# Altium schematic sheet microcontroller.SchDoc: Microcontroller
size A4; SheetNumber: 3; SheetTotal: 7
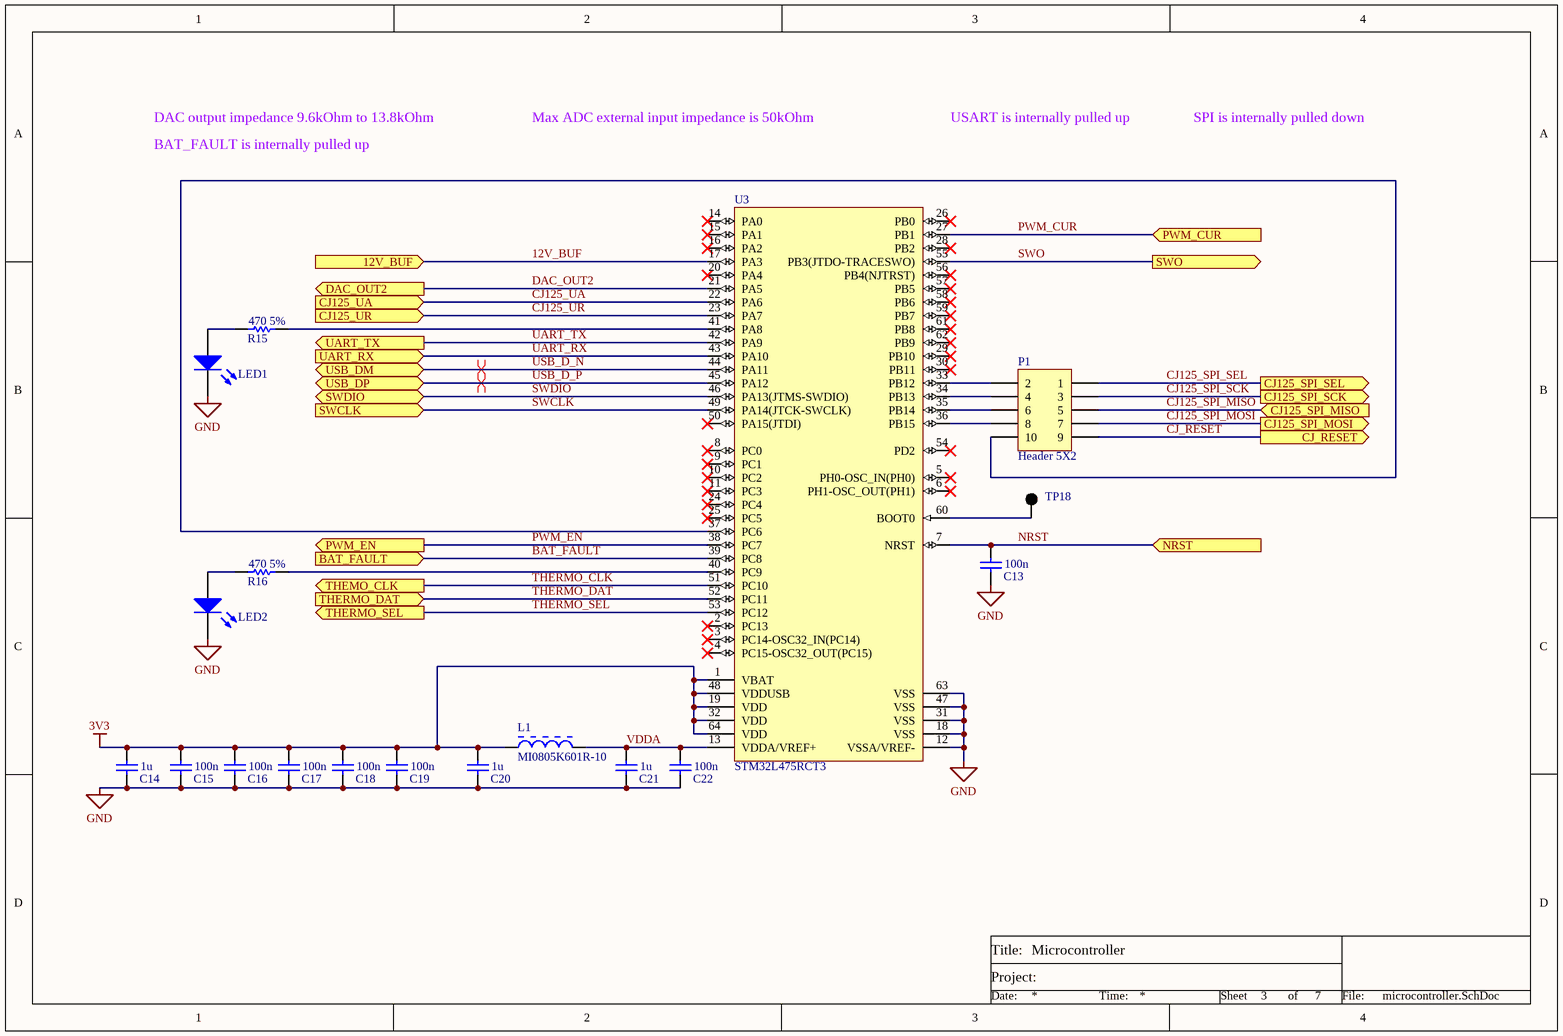
[diagram p0: microcontroller.SchDoc]

## Parts
C13  value 100n  [0805]  (hidden comment: Generic 0805 Capacitor)
C14  value 1u  [1206]  (hidden comment: Generic 1206 Capacitor)
C15  value 100n  [0805]  (hidden comment: Generic 0805 Capacitor)
C16  value 100n  [0805]  (hidden comment: Generic 0805 Capacitor)
C17  value 100n  [0805]  (hidden comment: Generic 0805 Capacitor)
C18  value 100n  [0805]  (hidden comment: Generic 0805 Capacitor)
C19  value 100n  [0805]  (hidden comment: Generic 0805 Capacitor)
C20  value 1u  [1206]  (hidden comment: Generic 1206 Capacitor)
C21  value 1u  [1206]  (hidden comment: Generic 1206 Capacitor)
C22  value 100n  [0805]  (hidden comment: Generic 0805 Capacitor)
L1  MI0805K601R-10  [0805]
LED1  150080SS75000  [0805_A]  (value not drawn)
LED2  150080SS75000  [0805_A]  (value not drawn)
P1  Header 5X2  [HDR2X5]
R15  value 470 5%  [0603]  (hidden comment: Generic 0603 Resistor)
R16  value 470 5%  [0603]  (hidden comment: Generic 0603 Resistor)
TP18  5001  [KSTN-5001]  (value not drawn)
U3  STM32L475RCT3  [STM-LQFP64_L]

## Ports
12V_BUF (in), BAT_FAULT (in), CJ125_SPI_MISO (in), CJ125_SPI_MOSI (out), CJ125_SPI_SCK (out), CJ125_SPI_SEL (out), CJ125_UA (in), CJ125_UR (in), CJ_RESET (out), DAC_OUT2 (out), NRST (in), PWM_CUR (in), PWM_EN (out), SWCLK (in), SWDIO (bidir), SWO (out), THEMO_CLK (out), THERMO_DAT (in), THERMO_SEL (out), UART_RX (in), UART_TX (out), USB_DM (bidir), USB_DP (bidir)

## Nets
3V3: C14.2 C15.2 C16.2 C17.2 C18.2 C19.2 C20.2 L1.1 U3.1(VBAT) U3.19(VDD) U3.32(VDD) U3.48(VDDUSB) U3.64(VDD)
GND: C13.1 C14.1 C15.1 C16.1 C17.1 C18.1 C19.1 C20.1 C21.1 C22.1 LED1.1(K) LED2.1(K) U3.12(VSSA/VREF-) U3.18(VSS) U3.31(VSS) U3.47(VSS) U3.63(VSS)
12V_BUF: U3.17(PA3) ; port 12V_BUF
BAT_FAULT: U3.39(PC8) ; port BAT_FAULT
CJ125_SPI_MISO: P1.5 ; port CJ125_SPI_MISO
CJ125_SPI_MOSI: P1.7 ; port CJ125_SPI_MOSI
CJ125_SPI_SCK: P1.3 ; port CJ125_SPI_SCK
CJ125_SPI_SEL: P1.1 ; port CJ125_SPI_SEL
CJ125_UA: U3.22(PA6) ; port CJ125_UA
CJ125_UR: U3.23(PA7) ; port CJ125_UR
CJ_RESET: P1.9 ; port CJ_RESET
DAC_OUT2: U3.21(PA5) ; port DAC_OUT2
NRST: C13.2 U3.7(NRST) ; port NRST
PWM_CUR: U3.27(PB1) ; port PWM_CUR
PWM_EN: U3.38(PC7) ; port PWM_EN
SWCLK: U3.49(PA14(JTCK-SWCLK)) ; port SWCLK
SWDIO: U3.46(PA13(JTMS-SWDIO)) ; port SWDIO
SWO: U3.55(PB3(JTDO-TRACESWO)) ; port SWO
THERMO_CLK: U3.51(PC10) ; port THEMO_CLK
THERMO_DAT: U3.52(PC11) ; port THERMO_DAT
THERMO_SEL: U3.53(PC12) ; port THERMO_SEL
UART_RX: U3.43(PA10) ; port UART_RX
UART_TX: U3.42(PA9) ; port UART_TX
USB_D_N: U3.44(PA11) ; port USB_DM
USB_D_P: U3.45(PA12) ; port USB_DP
VDDA: C21.2 C22.2 L1.2 U3.13(VDDA/VREF+)
NetLED1_2: LED1.2(A) R15.1
NetLED2_2: LED2.2(A) R16.1
NetP1_2: P1.2 U3.33(PB12)
NetP1_4: P1.4 U3.34(PB13)
NetP1_6: P1.6 U3.35(PB14)
NetP1_8: P1.8 U3.36(PB15)
NetP1_10: P1.10 U3.37(PC6)
NetR15_2: R15.2 U3.41(PA8)
NetR16_2: R16.2 U3.40(PC9)
NetTP18_1: TP18.1 U3.60(BOOT0)

Not connected (* = marked no-connect by the designer): U3 2(PC13)* 3(PC14-OSC32_IN(PC14))* 4(PC15-OSC32_OUT(PC15))* 5(PH0-OSC_IN(PH0))* 6(PH1-OSC_OUT(PH1))* 8(PC0)* 9(PC1)* 10(PC2)* 11(PC3)* 14(PA0)* 15(PA1)* 16(PA2)* 20(PA4)* 24(PC4)* 25(PC5)* 26(PB0)* 28(PB2)* 29(PB10)* 30(PB11)* 50(PA15(JTDI))* 54(PD2)* 56(PB4(NJTRST))* 57(PB5)* 58(PB6)* 59(PB7)* 61(PB8)* 62(PB9)*

## Layout directives
differential pair: USB_D_N, USB_D_P

## Notes on the sheet
- DAC output impedance 9.6kOhm to 13.8kOhm
- BAT_FAULT is internally pulled up
- Max ADC external input impedance is 50kOhm
- USART is internally pulled up
- SPI is internally pulled down
- Title
- Title:
- Project:
- Size:
- Date:
- File:
- E
- Number:
- Time:
- Revision:
- Sheet
- of

## Library data of the parts
C13 C15-C19 C22 = C_0805: Specifications: *
C14 C20 C21 = C_1206: Specifications: *
L1 = MI0805K: Chip Bead for Power Filtering, 1500 mA, 600 Ohm, -40 to 125 degC, 0805 (2012 Metric), RoHS, Tape and Reel; Manufacturer: Laird; Filter Type: PowerLine; Current Rating (Max): 1.5A; Catalog Drawings: (HI,HZ,LI,MI)0805Series_1.10mmMax.Height; Impedance @ Frequency: 600Ohm@100MHz; Number of Lines: 1; DC Resistance (DCR) (Max): 100mOhm; Other Names: 240-2390-1; Kits: 240-2227-ND-KITEMIFERRITEBEADCHIPSMD; Online Catalog: MISeries; Standard Package: 1; Datasheet Version: Rev. A, 01/2004; Height (Max): 0.043"(1.10mm); Category: Filters; Operating Temperature: -40degC~125degC; Package Description: 2-Pin Surface Mount Device, Body 2 x 1.25 mm; Package / Case: 0805(2012Metric); Package Reference: MI0805K601R-10-2; Packaging: CutTape(CT); Ratings: -; Mounting Type: SurfaceMount; Datasheet URL: https://datasheet.ciiva.com/3082/mi0805k601r-10-a-vp-3082219.pdf; Size / Dimension: 0.079"Lx0.049"W(2.00mmx1.25mm); Family: FerriteBeadsandChips; Manufacturer URL: https://www.lairdtech.com; Series: MI
LED1 LED2 = LED_0805: SMD mono-color Chip LED, WL-SMCW, Super Red; Manufacturer: Wuerth Elektronik; PackageReference: 0805_A; ComponentLink2URL: http://katalog.we-online.com/led/datasheet/150080SS75000.pdf; ComponentLink1URL: http://www.we-online.com; Color: Super Red; ComponentLink2Description: Datasheet; ComponentLink1Description: Manufacturer URL; PartNumber: 150080SS75000
P1 = Header 5X2: Header, 5-Pin, Dual row; LatestRevisionDate: 17-Jul-2002; LatestRevisionNote: Re-released for DXP Platform.; Publisher: Altium Limited
R15 R16 = R_0603: Specifications: *
TP18 = TP5001: Test Point, Black, 1-Pin THD, RoHS, Bulk; Manufacturer: Keystone; Other Names: 5001K; Catalog Drawings: 5000Series; Alternate Color: 5004K-ND / -TESTPOINTPCMINI.040"DYELLOW / 5003K-ND / -TESTPOINTPCMINI.040"DORANGE / 5002K-ND / -TESTPOINTPCMINI.040"DWHITE / 5000K-ND / -TESTPOINTPCMINI.040"DRED; Kits: DKTGRS232C-KIT-ND / -TTLCONVERTER; Online Catalog: ColorCodedTestPoints; Datasheet URL: https://ciiva.com/datasheet-click-2917627?src=ciiva&sig=bd195616; Mounting Type: 0.040"(1.02mm)HoleDiameter; Family: TestPoints; RoHS Information: RoHSComplianceStatement; Datasheet Version: Rev. G, 12/2008; Color: Black; Category: TestandMeasurement; Standard Package: 100; Manufacturer URL: http://www.keyelco.com/; Material: Base,Nylon46,UL94V-0; Type: PCTestPoint,Miniature; Terminal: 0.010"x0.020"(0.25mmx0.51mm)PhosphorBronzeWire,SilverPlated; Series: THM; Packaging: Bulk
U3 = STM32L475RCT3: Ultra-Low-Power ARM Cortex-M4 32-bit MCU+FPU, 256 KB Flash, 128 KB Internal RAM, 51 I/Os, 64-Pin LQFP, -40 to 125 degC, Tray; Operating Frequency(F) (Processor speed) (MHz): 80; Internal RAM Size (kB): 128; I/Os (High Current): 51; D/A Converter: 2; Supply Voltage(Vcc) min (V): 1.71; FLASH Size (Prog) (kB): 256; Package: LQFP64; Packing: Tray; DatasheetVersion: Rev. 4; Mounting Technology: Surface Mount; Core: ARM Cortex-M4; Package Description: 64-Pin Low-profile Quad Flat Package, Body 10 x 10 mm, Pitch 0.5 mm; ComponentLink1Description: Datasheet; ComponentLink1URL: http://www.st.com/content/ccc/resource/technical/document/datasheet/90/51/73/d2/53/60/4f/5f/DM00172872.pdf/files/DM00172872.pdf/jcr:content/translations/en.DM00172872.pdf; Supplier 1: Digi-Key; Supplier Part Number 1: 497-16840-ND